# Altium project LIA.PrjPcb
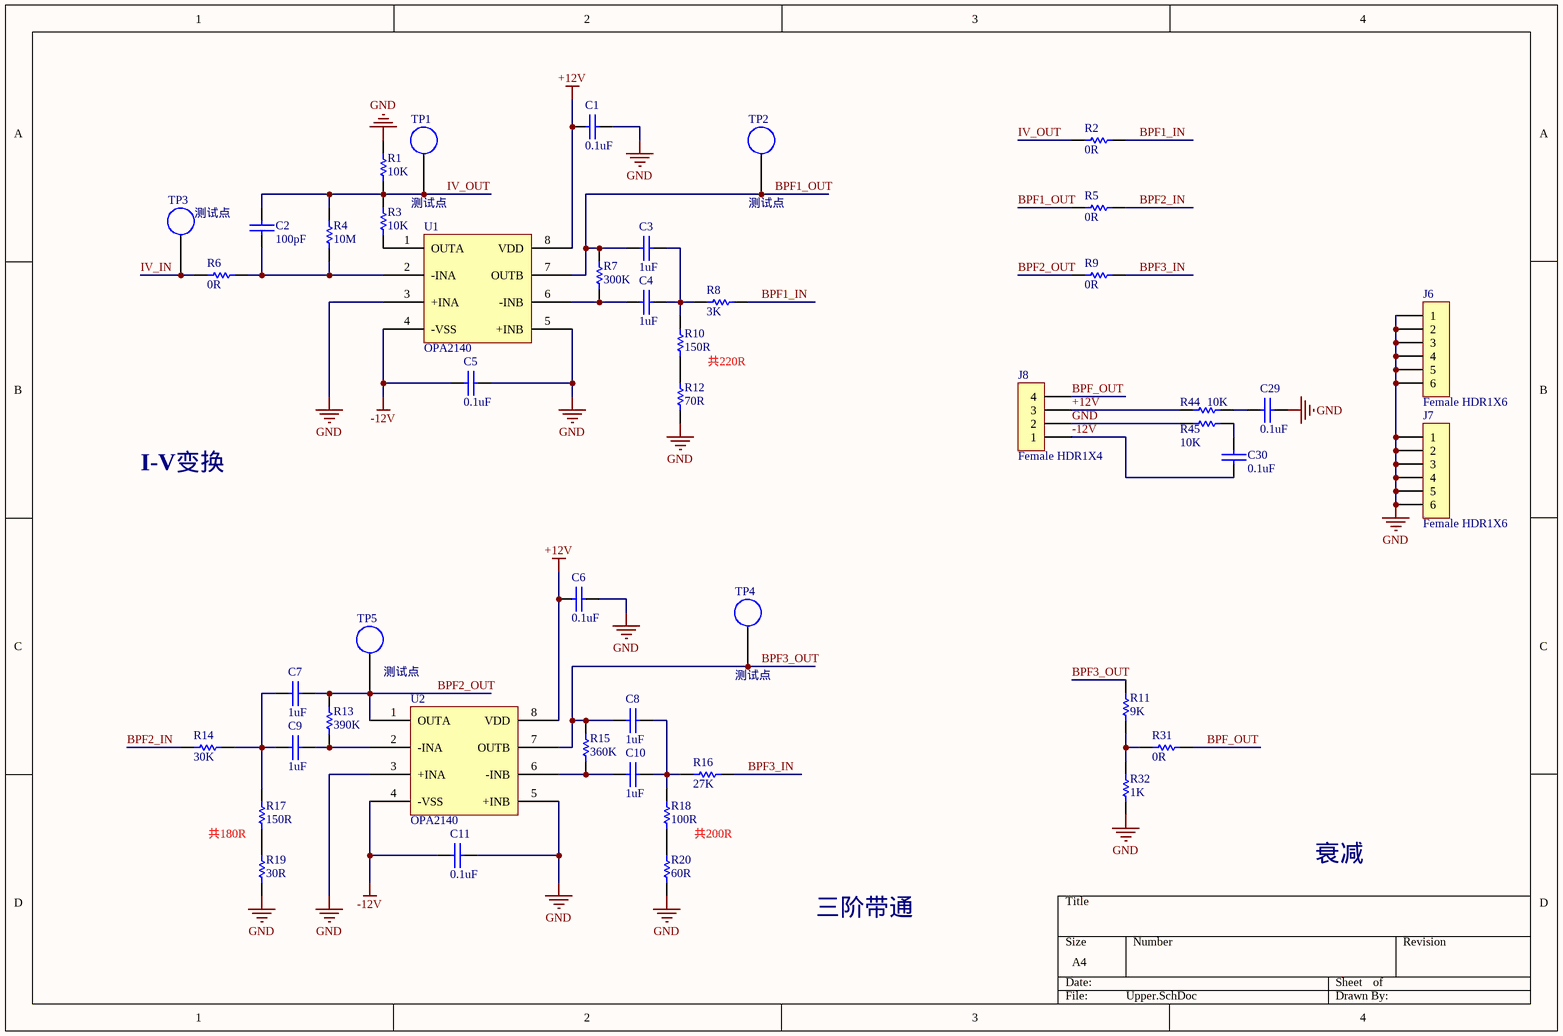
[diagram p0: Upper.SchDoc]
2 sheets, 108 parts. Net scope: global (net labels, ports and power ports of the same name join across sheets).
Board files: Upper.PcbDoc, Lower.PcbDoc
Sheets:
  Upper.SchDoc
  Lower.SchDoc

## Sheet Upper.SchDoc
size A4; SheetNumber: 1; SheetTotal: 2

### Parts
C1  0.1uF  [0603C]
C2  100pF  [0603C]
C3  1uF  [1206C]
C4  1uF  [1206C]
C5  0.1uF  [0603C]
C6  0.1uF  [0603C]
C7  1uF  [1206C]
C8  1uF  [1206C]
C9  1uF  [1206C]
C10  1uF  [1206C]
C11  0.1uF  [0603C]
C29  0.1uF  [0603C]
C30  0.1uF  [0603C]
J6  Female HDR1X6  [Fe-HDR1X6/2.54-S]
J7  Female HDR1X6  [Fe-HDR1X6/2.54-S]
J8  Female HDR1X4  [Fe-HDR1X4/2.54-S]
R1  10K  [0603R]
R2  0R  [0603R]
R3  10K  [0603R]
R4  10M  [0603R]
R5  0R  [0603R]
R6  0R  [0603R]
R7  300K  [0603R]
R8  3K  [0603R]
R9  0R  [0603R]
R10  150R  [0603R]
R11  9K  [0603R]
R12  70R  [0603R]
R13  390K  [0603R]
R14  30K  [0603R]
R15  360K  [0603R]
R16  27K  [0603R]
R17  150R  [0603R]
R18  100R  [0603R]
R19  30R  [0603R]
R20  60R  [0603R]
R31  0R  [0603R]
R32  1K  [0603R]
R44  10K  [0603R]
R45  10K  [0603R]
TP1  测试点  [TP]
TP2  测试点  [TP]
TP3  测试点  [TP]
TP4  测试点  [TP]
TP5  测试点  [TP]
U1  OPA2140  [SOP8]
U2  OPA2140  [SOP8]

### Nets
+12V: C1.1 C6.1 J8.3 R44.2 U1.8(VDD) U2.8(VDD)
-12V: C5.1 C11.1 C30.1 J8.1 U1.4(-VSS) U2.4(-VSS)
GND: C1.2 C5.2 C6.2 C11.2 C29.1 J6.1 J6.2 J6.3 J6.4 J6.5 J6.6 J7.1 J7.2 J7.3 J7.4 J7.5 J7.6 J8.2 R1.2 R12.2 R19.2 R20.2 R32.1 R45.2 U1.3(+INA) U1.5(+INB) U2.3(+INA) U2.5(+INB)
BPF1_IN: R2.2 R8.1
BPF1_OUT: C3.2 R5.1 R7.2 TP2.1(TP) U1.7(OUTB)
BPF2_IN: R5.2 R14.2
BPF2_OUT: C7.1 R9.1 R13.2 TP5.1(TP) U2.1(OUTA)
BPF3_IN: R9.2 R16.1
BPF3_OUT: C8.2 R11.2 R15.2 TP4.1(TP) U2.7(OUTB)
BPF_OUT: J8.4 R31.1
IV_IN: R6.2 TP3.1(TP)
IV_OUT: C2.1 R1.1 R2.1 R3.2 R4.2 TP1.1(TP)
NetC2_2: C2.2 R4.1 R6.1 U1.2(-INA)
NetC3_1: C3.1 C4.2 R8.2 R10.1
NetC4_1: C4.1 R7.1 U1.6(-INB)
NetC7_2: C7.2 C9.1 R14.1 R17.1
NetC8_1: C8.1 C10.2 R16.2 R18.1
NetC9_2: C9.2 R13.1 U2.2(-INA)
NetC10_1: C10.1 R15.1 U2.6(-INB)
NetC29_2: C29.2 R44.1
NetC30_2: C30.2 R45.1
NetR3_1: R3.1 U1.1(OUTA)
NetR10_2: R10.2 R12.1
NetR11_1: R11.1 R31.2 R32.2
NetR17_2: R17.2 R19.1
NetR18_2: R18.2 R20.1

### Notes on the sheet
- 共220R
- I-V变换
- 共180R
- 共200R
- 三阶带通
- 衰减

### Library data of the parts
C1-C11 C29 C30 = CAP: 无极性电容
R1-R20 R31 R32 R44 R45 = RES
U1 U2 = NE5532

## Sheet Lower.SchDoc
size A3; SheetNumber: 2; SheetTotal: 2
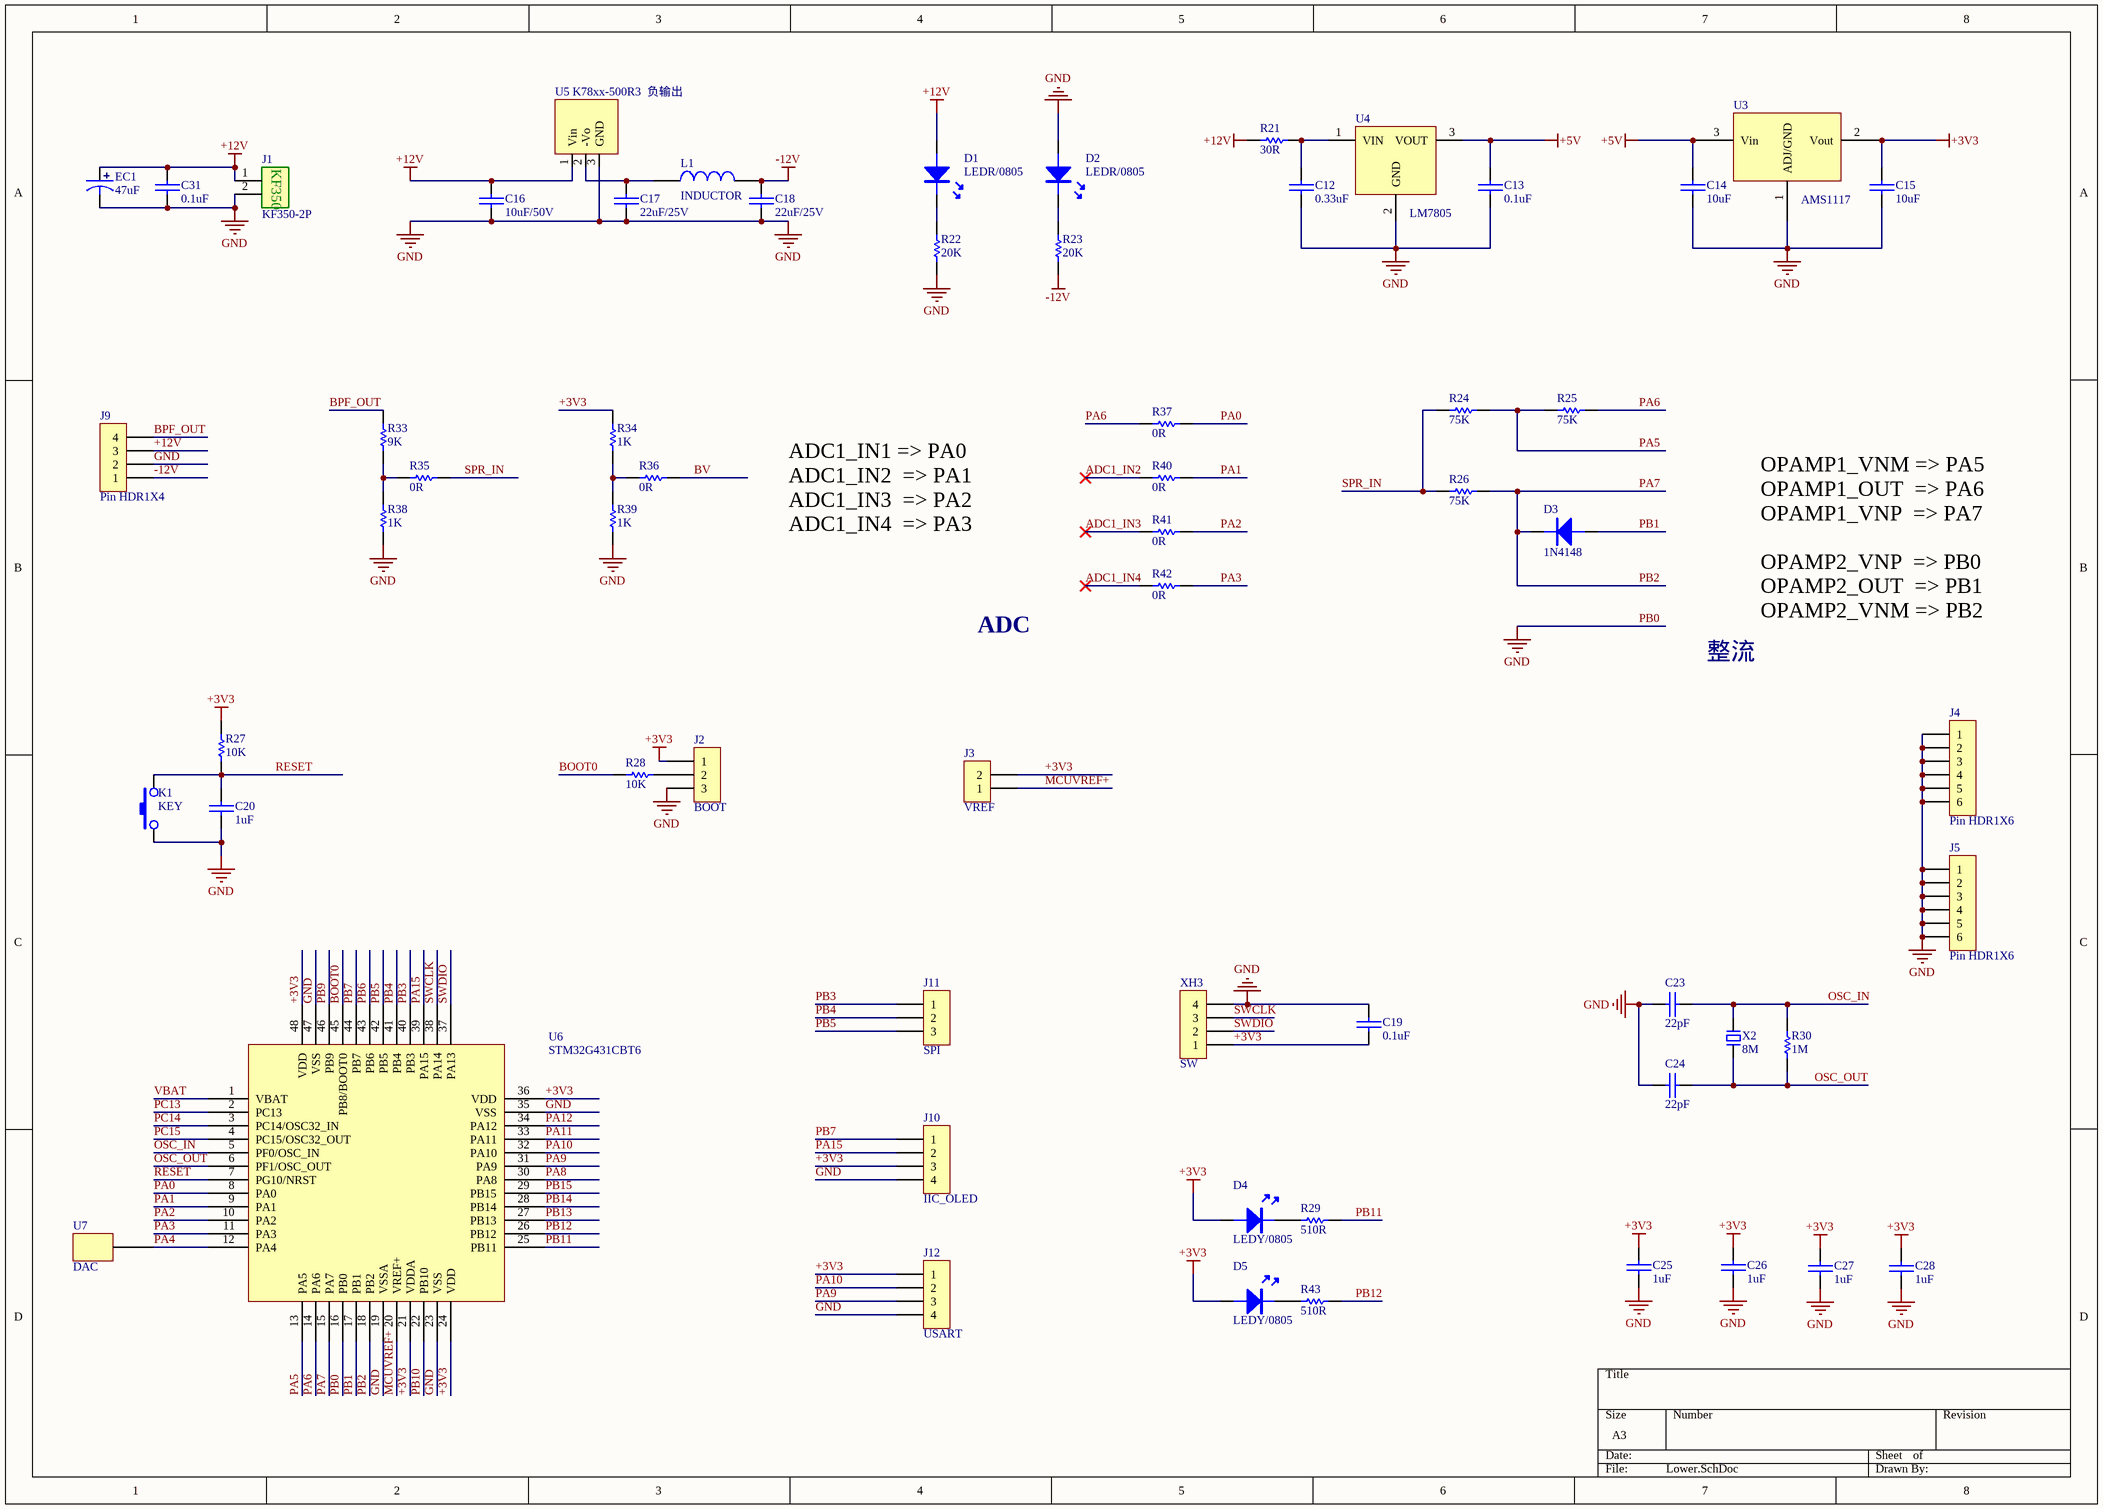
[diagram p1: Lower.SchDoc]

### Parts
C12  0.33uF  [0603C]
C13  0.1uF  [0603C]
C14  10uF  [0603C]
C15  10uF  [0603C]
C16  10uF/50V  [0603C]
C17  22uF/25V  [0603C]
C18  22uF/25V  [0603C]
C19  0.1uF  [0603C]
C20  1uF  [0603C]
C23  22pF  [0603C]
C24  22pF  [0603C]
C25  1uF  [0603C]
C26  1uF  [0603C]
C27  1uF  [0603C]
C28  1uF  [0603C]
C31  0.1uF  [0603C]
D1  LEDR/0805  [LED-0805R]
D2  LEDR/0805  [LED-0805R]
D3  1N4148  [SOD-123]
D4  LEDY/0805  [LED-0805B]
D5  LEDY/0805  [LED-0805G]
EC1  47uF  [SMD-EC5.0X5.3X5.4]
J1  KF350-2P  [KF350-2P]
J2  BOOT  [Pin HDR1X3/2.54mm-S]
J3  VREF  [Pin HDR1X2/2.54mm-S]
J4  Pin HDR1X6  [Pin HDR1X6/2.54mm-S]
J5  Pin HDR1X6  [Pin HDR1X6/2.54mm-S]
J9  Pin HDR1X4  [Pin HDR1X4/2.54mm-S]
J10  IIC_OLED  [Fe-HDR1X4/2.54-S]
J11  SPI  [Pin HDR1X3/2.54mm-S]
J12  USART  [Fe-HDR1X4/2.54-S]
K1  KEY  [SMD-3X6X2.5]
L1  INDUCTOR  [1210L]
R21  30R  [0603R]
R22  20K  [0603R]
R23  20K  [0603R]
R24  75K  [0603R]
R25  75K  [0603R]
R26  75K  [0603R]
R27  10K  [0603R]
R28  10K  [0603R]
R29  510R  [0603R]
R30  1M  [0603R]
R33  9K  [0603R]
R34  1K  [0603R]
R35  0R  [0603R]
R36  0R  [0603R]
R37  0R  [0603R]
R38  1K  [0603R]
R39  1K  [0603R]
R40  0R  [0603R]
R41  0R  [0603R]
R42  0R  [0603R]
R43  510R  [0603R]
U3  AMS1117  [SOT223]
U4  LM7805  [TO252]
U5  K78xx-500R3  负输出  [K78xx-500R3 负输出]
U6  STM32G431CBT6  [LQFP48 7X7]
U7  DAC  [通孔焊盘]
X2  8M  [OSC HC-49S]
XH3  SW  [XH4/2.54mm/90]

### Nets
+3V3: C15.2 C19.1 C25.2 C26.2 C27.2 C28.2 D4.A D5.A J2.1 J3.2 J10.3 J12.1 R27.1 R34.2 U3.2(Vout) U6.21(VDDA) U6.24(VDD) U6.36(VDD) U6.48(VDD) XH3.1
+5V: C13.2 C14.2 U3.3(Vin) U4.3(VOUT)
+12V: C16.2 C31.2 D1.A EC1.1 J1.1 J9.3 R21.1 U5.1(Vin)
-12V: C18.2 J9.1 L1.2 R23.2
GND: C12.1 C13.1 C14.1 C15.1 C16.1 C17.1 C18.1 C19.2 C20.1 C23.2 C24.2 C25.1 C26.1 C27.1 C28.1 C31.1 D2.A EC1.2 J1.2 J2.3 J4.1 J4.2 J4.3 J4.4 J4.5 J4.6 J5.1 J5.2 J5.3 J5.4 J5.5 J5.6 J9.2 J10.4 J12.4 K1.1 R22.2 R38.1 R39.1 U3.1(ADJ/GND) U4.2(GND) U5.3(GND) U6.16(PB0) U6.19(VSSA) U6.23(VSS) U6.35(VSS) U6.47(VSS) XH3.4  [also labelled PB0]
ADC1_IN2: R40.1
ADC1_IN3: R41.1
ADC1_IN4: R42.1
BOOT0: R28.1 U6.45(PB8/BOOT0)
BPF_OUT: J9.4 R33.2
BV: R36.1
MCUVREF+: J3.1 U6.20(VREF+)
OSC_IN: C23.1 R30.2 U6.5(PF0/OSC_IN) X2.2
OSC_OUT: C24.1 R30.1 U6.6(PF1/OSC_OUT) X2.1
PA0: R37.2 U6.8(PA0)
PA1: R40.2 U6.9(PA1)
PA2: R41.2 U6.10(PA2)
PA3: R42.2 U6.11(PA3)
PA4: U6.12(PA4) U7.Hole(Con)
PA5: R24.2 R25.1 U6.13(PA5)
PA6: R25.2 R37.1 U6.14(PA6)
PA7: D3.K R26.2 U6.15(PA7) U6.18(PB2)  [also labelled PB2]
PA8: U6.30(PA8)
PA9: J12.3 U6.31(PA9)
PA10: J12.2 U6.32(PA10)
PA11: U6.33(PA11)
PA12: U6.34(PA12)
PA15: J10.2 U6.39(PA15)
PB1: D3.A U6.17(PB1)
PB3: J11.1 U6.40(PB3)
PB4: J11.2 U6.41(PB4)
PB5: J11.3 U6.42(PB5)
PB6: U6.43(PB6)
PB7: J10.1 U6.44(PB7)
PB9: U6.46(PB9)
PB10: U6.22(PB10)
PB11: R29.2 U6.25(PB11)
PB12: R43.2 U6.26(PB12)
PB13: U6.27(PB13)
PB14: U6.28(PB14)
PB15: U6.29(PB15)
PC13: U6.2(PC13)
PC14: U6.3(PC14/OSC32_IN)
PC15: U6.4(PC15/OSC32_OUT)
RESET: C20.2 K1.3 R27.2 U6.7(PG10/NRST)
SPR_IN: R24.1 R26.1 R35.1
SWCLK: U6.38(PA14) XH3.3
SWDIO: U6.37(PA13) XH3.2
VBAT: U6.1(VBAT)
NetC12_2: C12.2 R21.2 U4.1(VIN)
NetC17_2: C17.2 L1.1 U5.2(-Vo)
NetD1_K: D1.K R22.1
NetD2_K: D2.K R23.1
NetD4_K: D4.K R29.1
NetD5_K: D5.K R43.1
NetJ2_2: J2.2 R28.2
NetR33_1: R33.1 R35.2 R38.2
NetR34_1: R34.1 R36.2 R39.2

### Notes on the sheet
- ADC1_IN1 => PA0
  ADC1_IN2  => PA1
  ADC1_IN3  => PA2
  ADC1_IN4  => PA3
- ADC
- OPAMP1_VNM => PA5
  OPAMP1_OUT  => PA6
  OPAMP1_VNP  => PA7
  OPAMP2_VNP  => PB0
  OPAMP2_OUT  => PB1
  OPAMP2_VNM => PB2
- 整流
- (in symbol KF350-2P) KF350

### Library data of the parts
C12-C20 C23-C28 C31 = CAP: 无极性电容
D1 D2 D4 D5 = LED
D3 = DIODE: 普通二极管
EC1 = SMD_ECAP: 贴片电解电容
J2 J11 = Pin HDR1X3
J3 = Pin HDR1X2
J10 J12 = Female HDR1X4
R21-R30 R33-R43 = RES
U3 = AMS1117: 三端稳压芯片
U7 = 过孔焊盘
X2 = XTAL-2P: 2脚无源脚晶振
XH3 = XH4

## Nets that join several sheets
+12V: Upper (6 pins), Lower (8 pins)
-12V: Upper (6 pins), Lower (C18.2 J9.1 L1.2 R23.2)
GND: Upper (28 pins), Lower (48 pins)
BPF_OUT: Upper (J8.4 R31.1), Lower (J9.4 R33.2)